# Altium schematic sheet Digital Input.SchDoc
size A; SheetNumber: 2; SheetTotal: 10
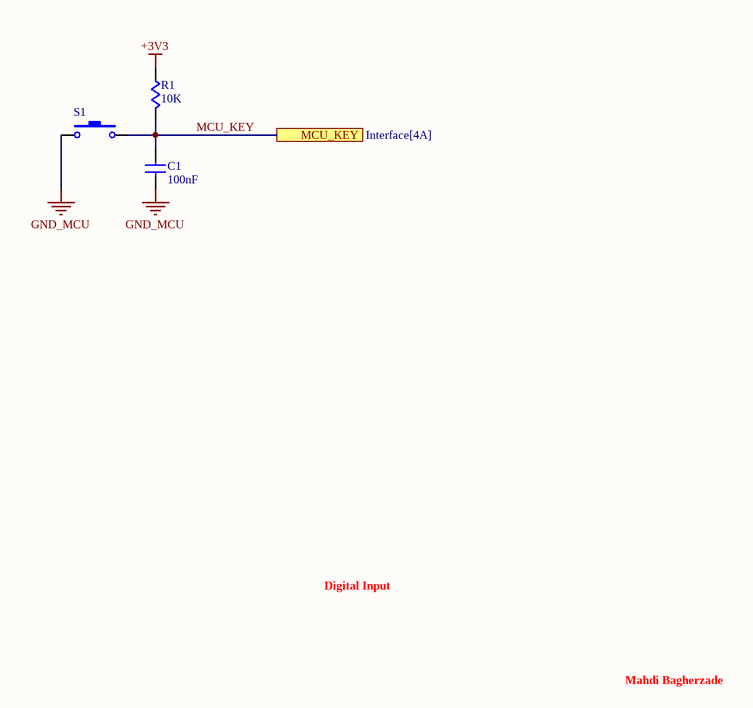
[diagram p0: Digital Input.SchDoc]

## Parts
C1  value 100nF  [C-0805]  (hidden comment: CAP Cer 100nF-50V-X7R-SMD)
R1  value 10K  [R-0805]
S1  UP  [SW-SMD-2pin-3x6]  (value not drawn)

## Ports
MCU_KEY (see Interface[4A])

## Nets
+3V3: R1.1
GND_MCU: C1.2 S1.1
MCU_KEY: C1.1 R1.2 S1.2 ; port MCU_KEY

## Notes on the sheet
- Digital Input
- Mahdi Bagherzade

## Library data of the parts
C1 = CAP-CER: CAPACITOR; Phone Number: 0915 8700 314; Voltage: 50V; Tolerance: X7R; Type: SMD; Publisher: Mahdi Bagherzadeh; ComponentLink1Description: Linkedin; ComponentLink1URL: https://ir.linkedin.com/in/mahdi-bagherzade; Published Date: 9-15-2024
R1 = RES: RESISTOR; Phone Number: 0915 8700 314; Tolerance: 5%; Power: 1/8W; Publisher: Mahdi Bagherzadeh; ComponentLink1Description: Linkedin; ComponentLink1URL: https://ir.linkedin.com/in/mahdi-bagherzade; Published Date: 9-15-2024
S1 = PUSH BUTTON: SWITCH; Phone Number: 0915 8700 314; Publisher: Mahdi Bagherzadeh; ComponentLink1Description: Linkedin; ComponentLink1URL: https://ir.linkedin.com/in/mahdi-bagherzade; Published Date: 9-15-2024; Size: 6x6